# EAGLE design pax_counter (EAGLE 9.4.2)
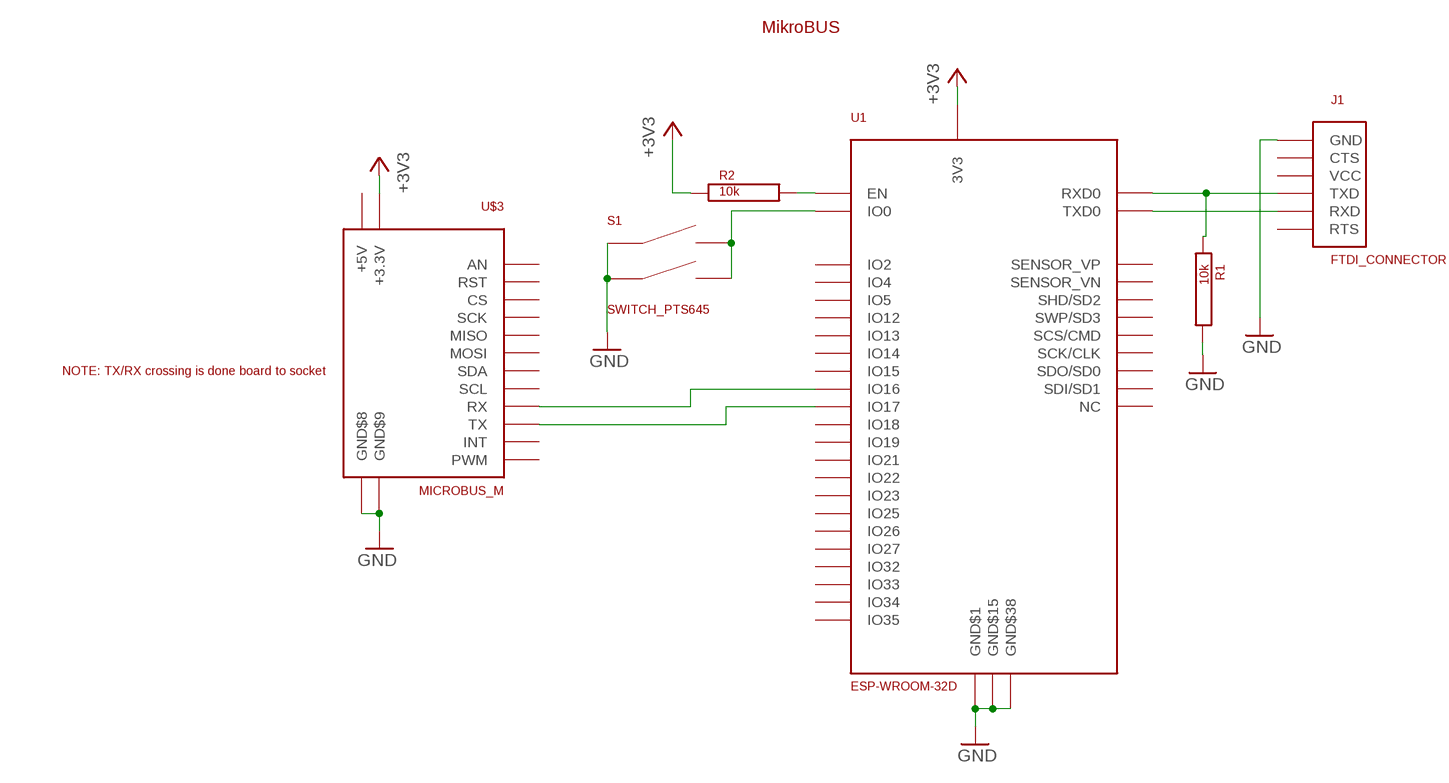
[diagram p0: schematic, sheet 1]

## Parts
J1  FTDI_CONNECTOR  [FTDI_CONNECTOR]
R1  10k  RESISTOR  [RES_0402]
R2  10k  RESISTOR  [RES_0402]
S1  SWITCH_PTS645  [SWITCH_PTS645_EE_NBIOT_01]
U1  ESP-WROOM-32D  [ESP_WROOM_32D]
U$1  MIKROBUS_LOGO  [MIKROBUS_LOGO]
U$3  MICROBUS_M  [MIKROBUS_M]

## Nets
+3V3: R2.P$1 U1.2(3V3) U$3.+3.3V
GND: J1.GND R1.P$2 S1.A1 S1.A2 U1.1(GND$1) U1.15(GND$15) U1.38(GND$38) U1.GND$39(GND$38) U1.GND$40(GND$38) U1.GND$41(GND$38) U1.GND$42(GND$38) U1.GND$43(GND$38) U1.GND$44(GND$38) U1.GND$45(GND$38) U1.GND$46(GND$38) U1.GND$47(GND$38) U$3.GND$8 U$3.GND$9
N$1: U1.27(IO16) U$3.RX
N$2: U1.28(IO17) U$3.TX
N$3: R2.P$2 U1.3(EN)
N$4: J1.TXD R1.P$1 U1.34(RXD0)
N$5: J1.RXD U1.35(TXD0)
N$6: S1.B1 S1.B2 U1.25(IO0)
Unconnected: J1.CTS J1.RTS J1.VCC U1.4(SENSOR_VP) U1.5(SENSOR_VN) U1.6(IO34) U1.7(IO35) U1.8(IO32) U1.9(IO33) U1.10(IO25) U1.11(IO26) U1.12(IO27) U1.13(IO14) U1.14(IO12) U1.16(IO13) U1.17(SHD/SD2) U1.18(SWP/SD3) U1.19(SCS/CMD) U1.20(SCK/CLK) U1.21(SDO/SD0) U1.22(SDI/SD1) U1.23(IO15) U1.24(IO2) U1.26(IO4) U1.29(IO5) U1.30(IO18) U1.31(IO19) U1.32(NC) U1.33(IO21) U1.36(IO22) U1.37(IO23) U$3.+5V U$3.AN U$3.CS U$3.INT U$3.MISO U$3.MOSI U$3.PWM U$3.RST U$3.SCK U$3.SCL U$3.SDA

## Library data of the parts
J1 = TimeExpander2:FTDI_CONNECTOR
R1 R2 = TimeExpander2:RESISTOR
S1 = TimeExpander2:SWITCH_PTS645
U1 = TimeExpander2:ESP-WROOM-32D
U$1 = TimeExpander2:MIKROBUS_LOGO
U$3 = TimeExpander2:MICROBUS_M

## Board
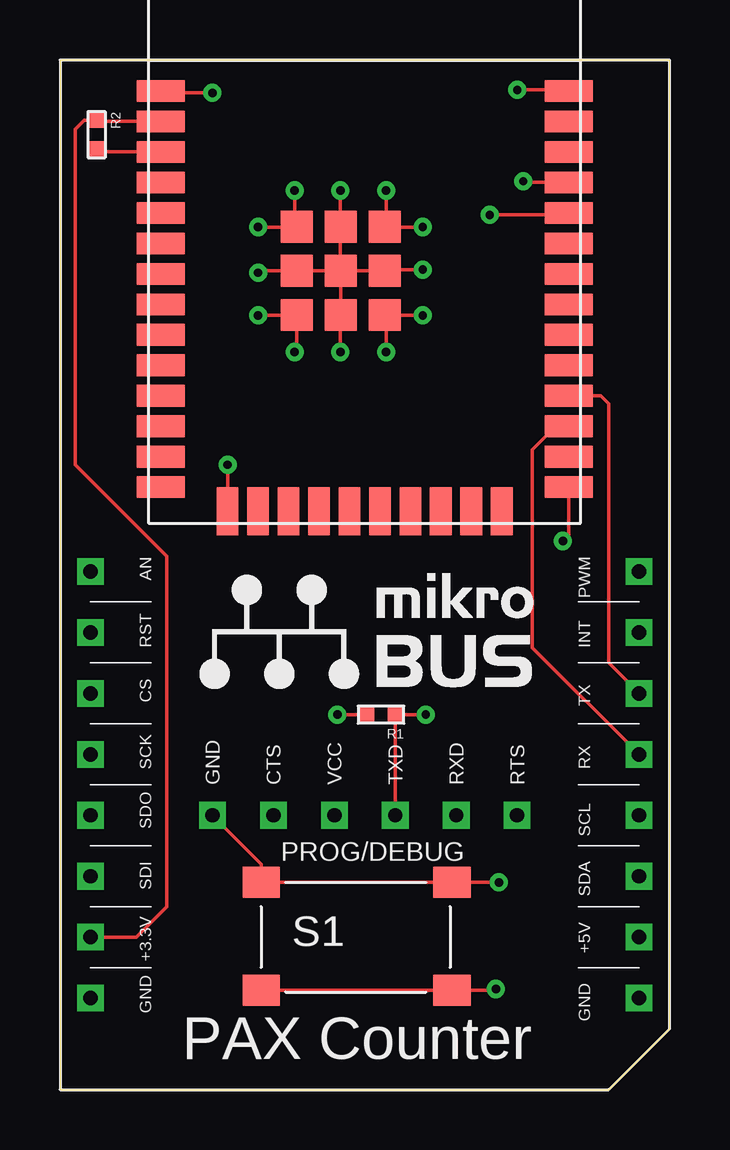
[diagram p1: board, top side]
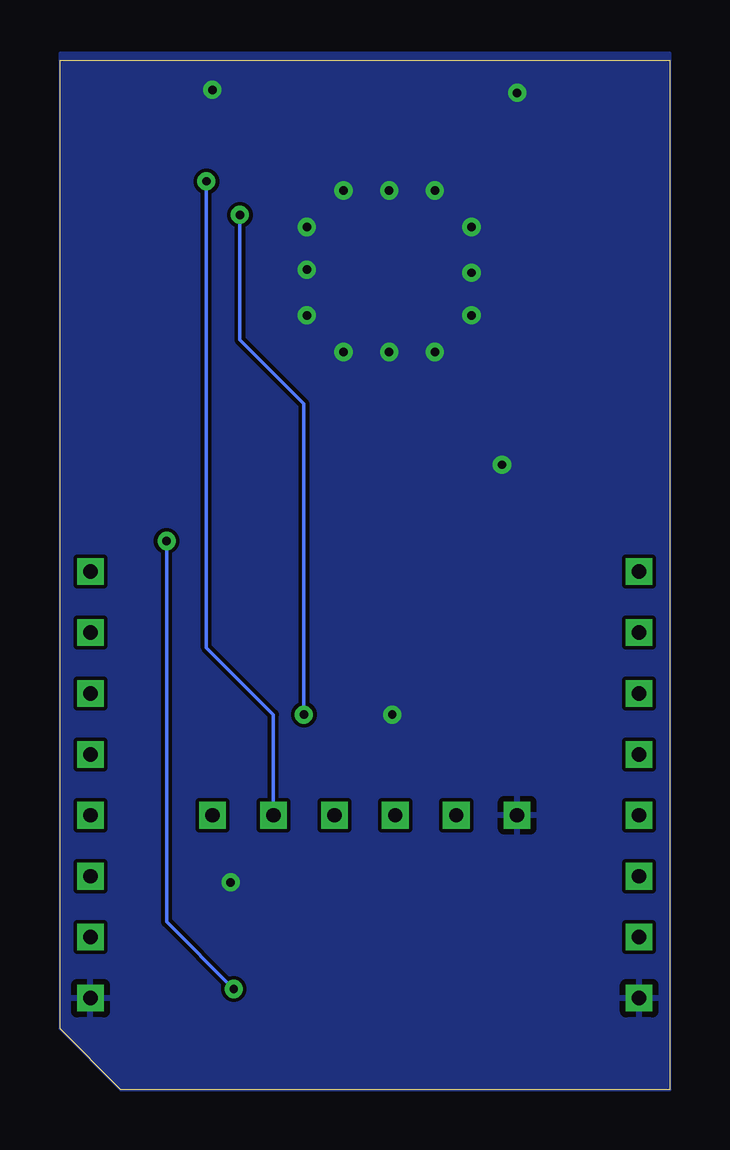
[diagram p2: board, bottom side, seen from below]

Size 25.4 x 42.9 mm. Coordinates in mm from the lower left corner, seen from the top.
Outline: 0,0 22.86,0 25.4,2.54 25.4,42.9 0,42.9 0,0
Copper layers (1*16): Top 0.035mm / dielectric 1.5mm / Bottom 0.035mm
Design rules "default *": minimum track width 6mil, minimum drill 0.35mm, track to track 6mil, track to pad 6mil, pad to pad 6mil, via to via 6mil, smd to smd 6mil, copper to edge 0mil, drill to drill 6mil, minimum pad ring 10mil, minimum via ring 8mil, stop-mask expansion 4mil, vias tented up to drill 0mil, thermal gap 10mil

### Footprints (pad centres in the part's own frame; a part is rotated, then mirrored left to right if it is on the bottom)
FTDI_CONNECTOR = drill 0.6 square: CTS 2.54,0; GND 0,0; RTS 12.7,0; RXD 10.16,0; TXD 7.62,0; VCC 5.08,0
RES_0402 = smd 0.635 x 0.61: P$1 0,0; P$2 1.194,0
SWITCH_PTS645_EE_NBIOT_01 = smd 1.55 x 1.3: A1 0,0; A2 7.95,0; B1 0,-4.5; B2 7.95,-4.5
ESP_WROOM_32D = smd 2 x 0.9: 1 0,16.51; 2 0,15.24; 3 0,13.97; 4 0,12.7; 5 0,11.43; 6 0,10.16; 7 0,8.89; 8 0,7.62; 9 0,6.35; 10 0,5.08; 11 0,3.81; 12 0,2.54; 13 0,1.27; 14 0,0; 25 17,0; 26 17,1.27; 27 17,2.54; 28 17,3.81; 29 17,5.08; 30 17,6.35; 31 17,7.62; 32 17,8.89; 33 17,10.16; 34 17,11.43; 35 17,12.7; 36 17,13.97; 37 17,15.24; 38 17,16.51 | smd 0.9 x 2: 15 2.785,-1; 16 4.055,-1; 17 5.325,-1; 18 6.595,-1; 19 7.865,-1; 20 9.135,-1; 21 10.405,-1; 22 11.675,-1; 23 12.945,-1; 24 14.215,-1 | smd 1.33 x 1.33: GND$39 5.665,10.845; GND$40 7.5,10.845; GND$41 9.335,10.845; GND$42 5.665,9.01; GND$43 7.5,9.01; GND$44 9.335,9.01; GND$45 5.665,7.175; GND$46 7.5,7.175; GND$47 9.335,7.175
MIKROBUS_M = drill 0.6 square: +3.3V 0,2.54; +5V 22.86,2.54; AN 0,17.78; CS 0,12.7; GND$8 0,0; GND$9 22.86,0; INT 22.86,15.24; MISO 0,7.62; MOSI 0,5.08; PWM 22.86,17.78; RST 0,15.24; RX 22.86,10.16; SCK 0,10.16; SCL 22.86,7.62; SDA 22.86,5.08; TX 22.86,12.7

### Placement (x,y rotation side)
J1  6.35,11.43 0 top
R1  13.97,15.62 180 top
R2  1.52,40.39 270 top
S1  8.38,8.64 0 top
U1  4.19,25.1 0 top
U$1  5.08,16.51 0 top
U$3  1.27,3.81 0 top

### Tracks (layer width: path | path; a pad name or v marks a point on that pad's centre or on a via)
+3V3
  Top 0.152: U1.2 1.57,40.34 R2.P$1 1.02,40.39 0.64,40.01 0.64,26.04 4.45,22.23 4.45,7.62 3.17,6.35 U$3.+3.3V
GND  (via drill 0.35)
  Top 0.152: 4.32,41.27 U1.1 4.27,41.53 v6.35,41.53 | v19.05,41.66 21.14,41.66 U1.38 | v9.78,37.47 9.78,36.02 U1.GND$39 v8.26,35.94 | v11.68,37.47 U1.GND$40 | U1.GND$40 | v13.59,37.47 13.59,36.2 | 13.59,36.2 13.59,36.01 U1.GND$41 | v15.11,35.94 13.84,35.94 13.59,36.2 | v8.26,34.04 8.33,34.11 U1.GND$42 U1.GND$43 | v15.11,34.16 13.58,34.16 U1.GND$44 U1.GND$43 | U1.GND$43 U1.GND$40 | U1.GND$43 U1.GND$46 v11.68,30.73 | v8.26,32.26 8.27,32.27 U1.GND$45 9.86,30.81 v9.78,30.73 | v13.59,30.73 13.59,32.21 U1.GND$47 13.54,32.26 v15.11,32.26 | J1.GND 8.38,9.4 S1.A1 S1.A2 v18.29,8.64 | v11.56,15.62 R1.P$2 | v6.99,26.04 U1.15
  pour Bottom: 0,43.18 0,0 22.86,0 25.4,2.54 25.4,43.18
N$1
  Top 0.152: U$3.RX 19.68,18.41 19.68,26.67 20.66,27.64 U1.27
N$2
  Top 0.152: U$3.TX 22.86,17.78 22.86,28.57 22.52,28.91 U1.28
N$3
  Top 0.152: U1.3 1.65,39.07 R2.P$2
N$4  (via drill 0.35)
  Top 0.152: v17.91,36.45 21.11,36.45 U1.34 | J1.TXD R1.P$1 v15.24,15.62
  Bottom 0.152: v17.91,36.45 17.91,31.24 15.24,28.57 v15.24,15.62
N$5  (via drill 0.35)
  Top 0.152: v19.3,37.85 19.35,37.8 U1.35
  Bottom 0.152: J1.RXD 16.51,15.62 19.3,18.41 v19.3,37.85
N$6  (via drill 0.35)
  Top 0.152: U1.25 21.19,23.1 v20.95,22.86 | S1.B1 S1.B2 18.11,4.14 v18.16,4.19
  Bottom 0.152: v18.16,4.19 20.95,6.99 v20.95,22.86

### Text on the board
tPlace: PAX Counter